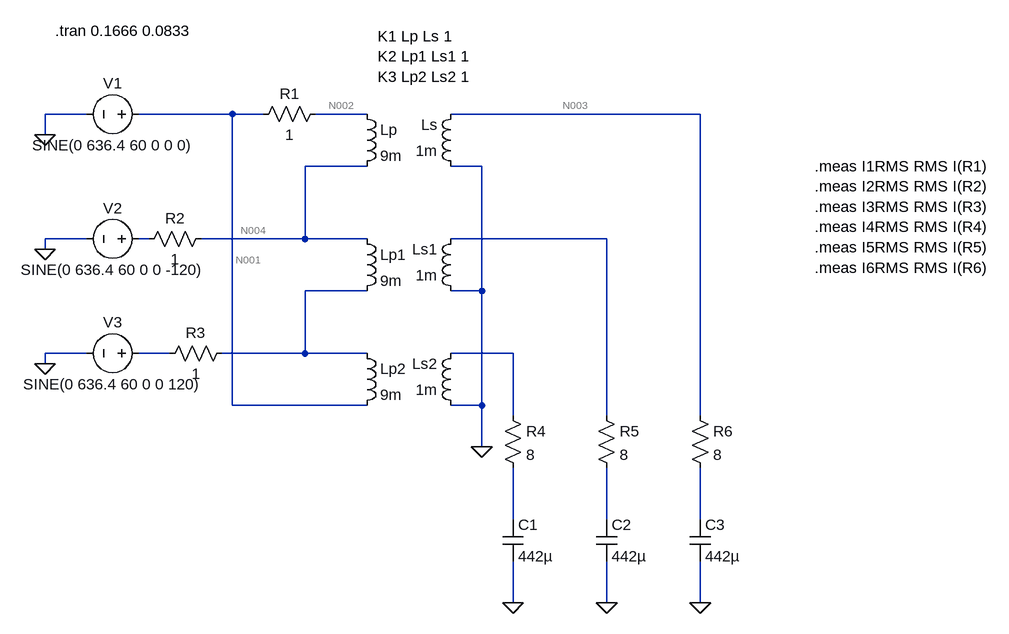
[diagram p0: schematic lab6.asc]
lab6.asc, the LTspice schematic file:
Version 4.1
SHEET 1 1132 788
WIRE -288 16 -352 16
WIRE -64 16 -208 16
WIRE -16 16 -64 16
WIRE 144 16 64 16
WIRE 656 16 272 16
WIRE -352 48 -352 16
WIRE 144 96 48 96
WIRE 320 96 272 96
WIRE -288 208 -352 208
WIRE -192 208 -208 208
WIRE 48 208 48 96
WIRE 48 208 -112 208
WIRE 144 208 48 208
WIRE 512 208 272 208
WIRE -352 224 -352 208
WIRE 144 288 48 288
WIRE 320 288 320 96
WIRE 320 288 272 288
WIRE -288 384 -352 384
WIRE -160 384 -208 384
WIRE 48 384 48 288
WIRE 48 384 -80 384
WIRE 144 384 48 384
WIRE 368 384 272 384
WIRE -352 400 -352 384
WIRE -64 464 -64 16
WIRE 144 464 -64 464
WIRE 320 464 320 288
WIRE 320 464 272 464
WIRE 368 480 368 384
WIRE 512 480 512 208
WIRE 656 480 656 16
WIRE 320 528 320 464
WIRE 368 640 368 560
WIRE 512 640 512 560
WIRE 656 640 656 560
WIRE 368 768 368 704
WIRE 512 768 512 704
WIRE 656 768 656 704
FLAG -352 48 0
FLAG -352 224 0
FLAG -352 400 0
FLAG 368 768 0
FLAG 512 768 0
FLAG 656 768 0
FLAG 320 528 0
SYMBOL ind 128 0 R0
SYMATTR InstName Lp
SYMATTR Value 9m
SYMBOL ind 288 112 R180
WINDOW 0 36 80 Left 2
WINDOW 3 36 40 Left 2
SYMATTR InstName Ls
SYMATTR Value 1m
SYMBOL voltage -192 16 R90
WINDOW 0 -32 56 VBottom 2
WINDOW 3 32 56 VTop 2
WINDOW 123 0 0 Left 0
WINDOW 39 0 0 Left 0
SYMATTR InstName V1
SYMATTR Value SINE(0 636.4 60 0 0 0)
SYMBOL ind 128 192 R0
SYMATTR InstName Lp1
SYMATTR Value 9m
SYMBOL ind 128 368 R0
SYMATTR InstName Lp2
SYMATTR Value 9m
SYMBOL voltage -192 208 R90
WINDOW 0 -32 56 VBottom 2
WINDOW 3 32 56 VTop 2
WINDOW 123 0 0 Left 0
WINDOW 39 0 0 Left 0
SYMATTR InstName V2
SYMATTR Value SINE(0 636.4 60 0 0 -120)
SYMBOL voltage -192 384 R90
WINDOW 0 -32 56 VBottom 2
WINDOW 3 32 56 VTop 2
WINDOW 123 0 0 Left 0
WINDOW 39 0 0 Left 0
SYMATTR InstName V3
SYMATTR Value SINE(0 636.4 60 0 0 120)
SYMBOL res 80 0 R90
WINDOW 0 0 56 VBottom 2
WINDOW 3 32 56 VTop 2
SYMATTR InstName R1
SYMATTR Value 1
SYMBOL res -96 192 R90
WINDOW 0 0 56 VBottom 2
WINDOW 3 32 56 VTop 2
SYMATTR InstName R2
SYMATTR Value 1
SYMBOL res -64 368 R90
WINDOW 0 0 56 VBottom 2
WINDOW 3 32 56 VTop 2
SYMATTR InstName R3
SYMATTR Value 1
SYMBOL ind 288 304 R180
WINDOW 0 36 80 Left 2
WINDOW 3 36 40 Left 2
SYMATTR InstName Ls1
SYMATTR Value 1m
SYMBOL ind 288 480 R180
WINDOW 0 36 80 Left 2
WINDOW 3 36 40 Left 2
SYMATTR InstName Ls2
SYMATTR Value 1m
SYMBOL res 352 464 R0
SYMATTR InstName R4
SYMATTR Value 8
SYMBOL res 496 464 R0
SYMATTR InstName R5
SYMATTR Value 8
SYMBOL res 640 464 R0
SYMATTR InstName R6
SYMATTR Value 8
SYMBOL cap 352 640 R0
SYMATTR InstName C1
SYMATTR Value 442µ
SYMBOL cap 496 640 R0
SYMATTR InstName C2
SYMATTR Value 442µ
SYMBOL cap 640 640 R0
SYMATTR InstName C3
SYMATTR Value 442µ
TEXT -336 -112 Left 2 !.tran 0.1666 0.0833
TEXT 160 -104 Left 2 !K1 Lp Ls 1\nK2 Lp1 Ls1 1\nK3 Lp2 Ls2 1
TEXT 832 96 Left 2 !.meas I1RMS RMS I(R1)\n.meas I2RMS RMS I(R2)\n.meas I3RMS RMS I(R3)\n.meas I4RMS RMS I(R4)\n.meas I5RMS RMS I(R5)\n.meas I6RMS RMS I(R6)

The netlist it stands for:
* lab6.asc
Lp N002 N004 9m
Ls 0 N003 1m
V1 N001 0 SINE(0 636.4 60 0 0 0)
Lp1 N004 N007 9m
Lp2 N007 N001 9m
V2 N005 0 SINE(0 636.4 60 0 0 -120)
V3 N008 0 SINE(0 636.4 60 0 0 120)
R1 N002 N001 1
R2 N004 N005 1
R3 N007 N008 1
Ls1 0 N006 1m
Ls2 0 N009 1m
R4 N009 N010 8
R5 N006 N011 8
R6 N003 N012 8
C1 N010 0 442µ
C2 N011 0 442µ
C3 N012 0 442µ
.tran 0.1666 0.0833
K1 Lp Ls 1
K2 Lp1 Ls1 1
K3 Lp2 Ls2 1
.meas I1RMS RMS I(R1)
.meas I2RMS RMS I(R2)
.meas I3RMS RMS I(R3)
.meas I4RMS RMS I(R4)
.meas I5RMS RMS I(R5)
.meas I6RMS RMS I(R6)
.backanno
.end

* Results of the author's LTspice run, read from the files saved beside the schematic
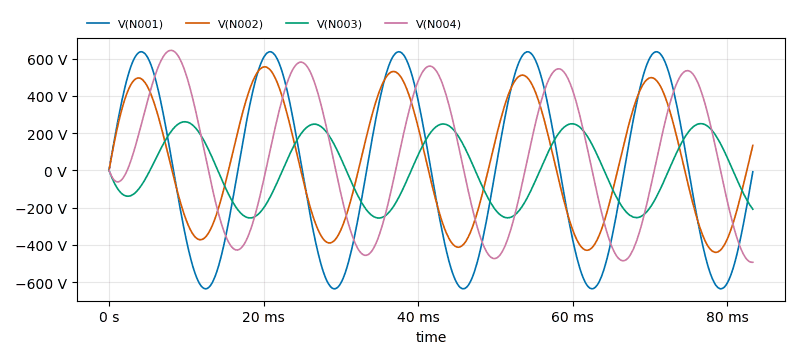
[diagram p1: Transient Analysis of lab6.asc, plotted from the saved traces]
* Transient Analysis, 1 run:
*   V(N001): min -636.4 V, max 636.4 V, average -13.97 mV, rms 450.1 V, last -7.997 V
*   V(N002): min -440.8 V, max 555.1 V, average 52.8 V, rms 331.8 V, last 133.4 V
*   V(N003): min -256.3 V, max 260.4 V, average 5.398 V, rms 173.6 V, last -209.1 V
*   V(N004): min -494.2 V, max 643.7 V, average 69 V, rms 368.2 V, last -493.8 V
* From the log:
*   i1rms: RMS(I(R1))=165.266909528 FROM 0 TO 0.0833
*   i2rms: RMS(I(R2))=281.133937328 FROM 0 TO 0.0833
*   i3rms: RMS(I(R3))=366.278651531 FROM 0 TO 0.0833
*   i4rms: RMS(I(R4))=25.9575578178 FROM 0 TO 0.0833
*   i5rms: RMS(I(R5))=18.0619418973 FROM 0 TO 0.0833
*   i6rms: RMS(I(R6))=17.3191028537 FROM 0 TO 0.0833